# Altium schematic sheet GPS.SchDoc
size A4
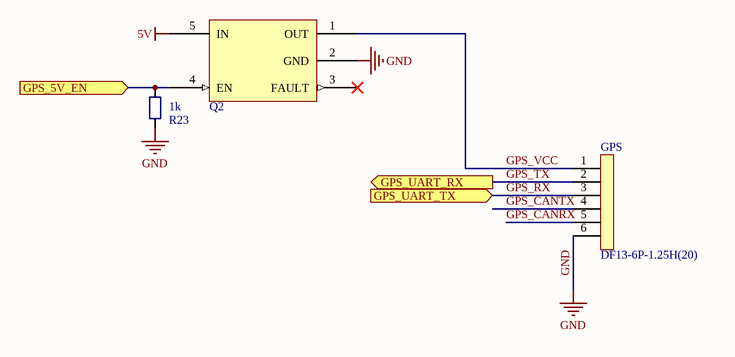
[diagram p0: GPS.SchDoc]

## Parts
GPS  DF13-6P-1.25H(20)  [DF13-6P-1.25H(20)]
Q2  Enhanced single channel power switches  [SOT-23-5]  (value not drawn)
R23  1k  [R0603H05_M]

## Ports
GPS_5V_EN (in), GPS_UART_RX (out), GPS_UART_TX (in)

## Nets
5V: Q2.5(IN)
GND: GPS.6 Q2.2(GND) R23.2
GPS_5V_EN: Q2.4(EN) R23.1 ; port GPS_5V_EN
GPS_CANRX: GPS.5
GPS_CANTX: GPS.4
GPS_RX: GPS.3 ; port GPS_UART_TX
GPS_TX: GPS.2 ; port GPS_UART_RX
GPS_VCC: GPS.1 Q2.1(OUT)

Not connected (* = marked no-connect by the designer): Q2 3(FAULT)*

## Library data of the parts
GPS = Hirose DF13-6P-1.25H(20): Circuits: 6; Connector Orientation: Right Angle; Model: DF13-6P-1.25H(20); Mounting Style: SMT
Q2 = HSS STMPS2151 High Side Switch 500mA (2151)/1000mA (2161): Farnell: http://de.farnell.com/stmicroelectronics/stmps2161str/power-switch-1ch-1000ma-sot23-5/dp/1842615; Farnell Order Number: 1842615; Price: 0,651
R23 = .Resistor: Value: 1k